# EAGLE design VCA (EAGLE 9.6.2)
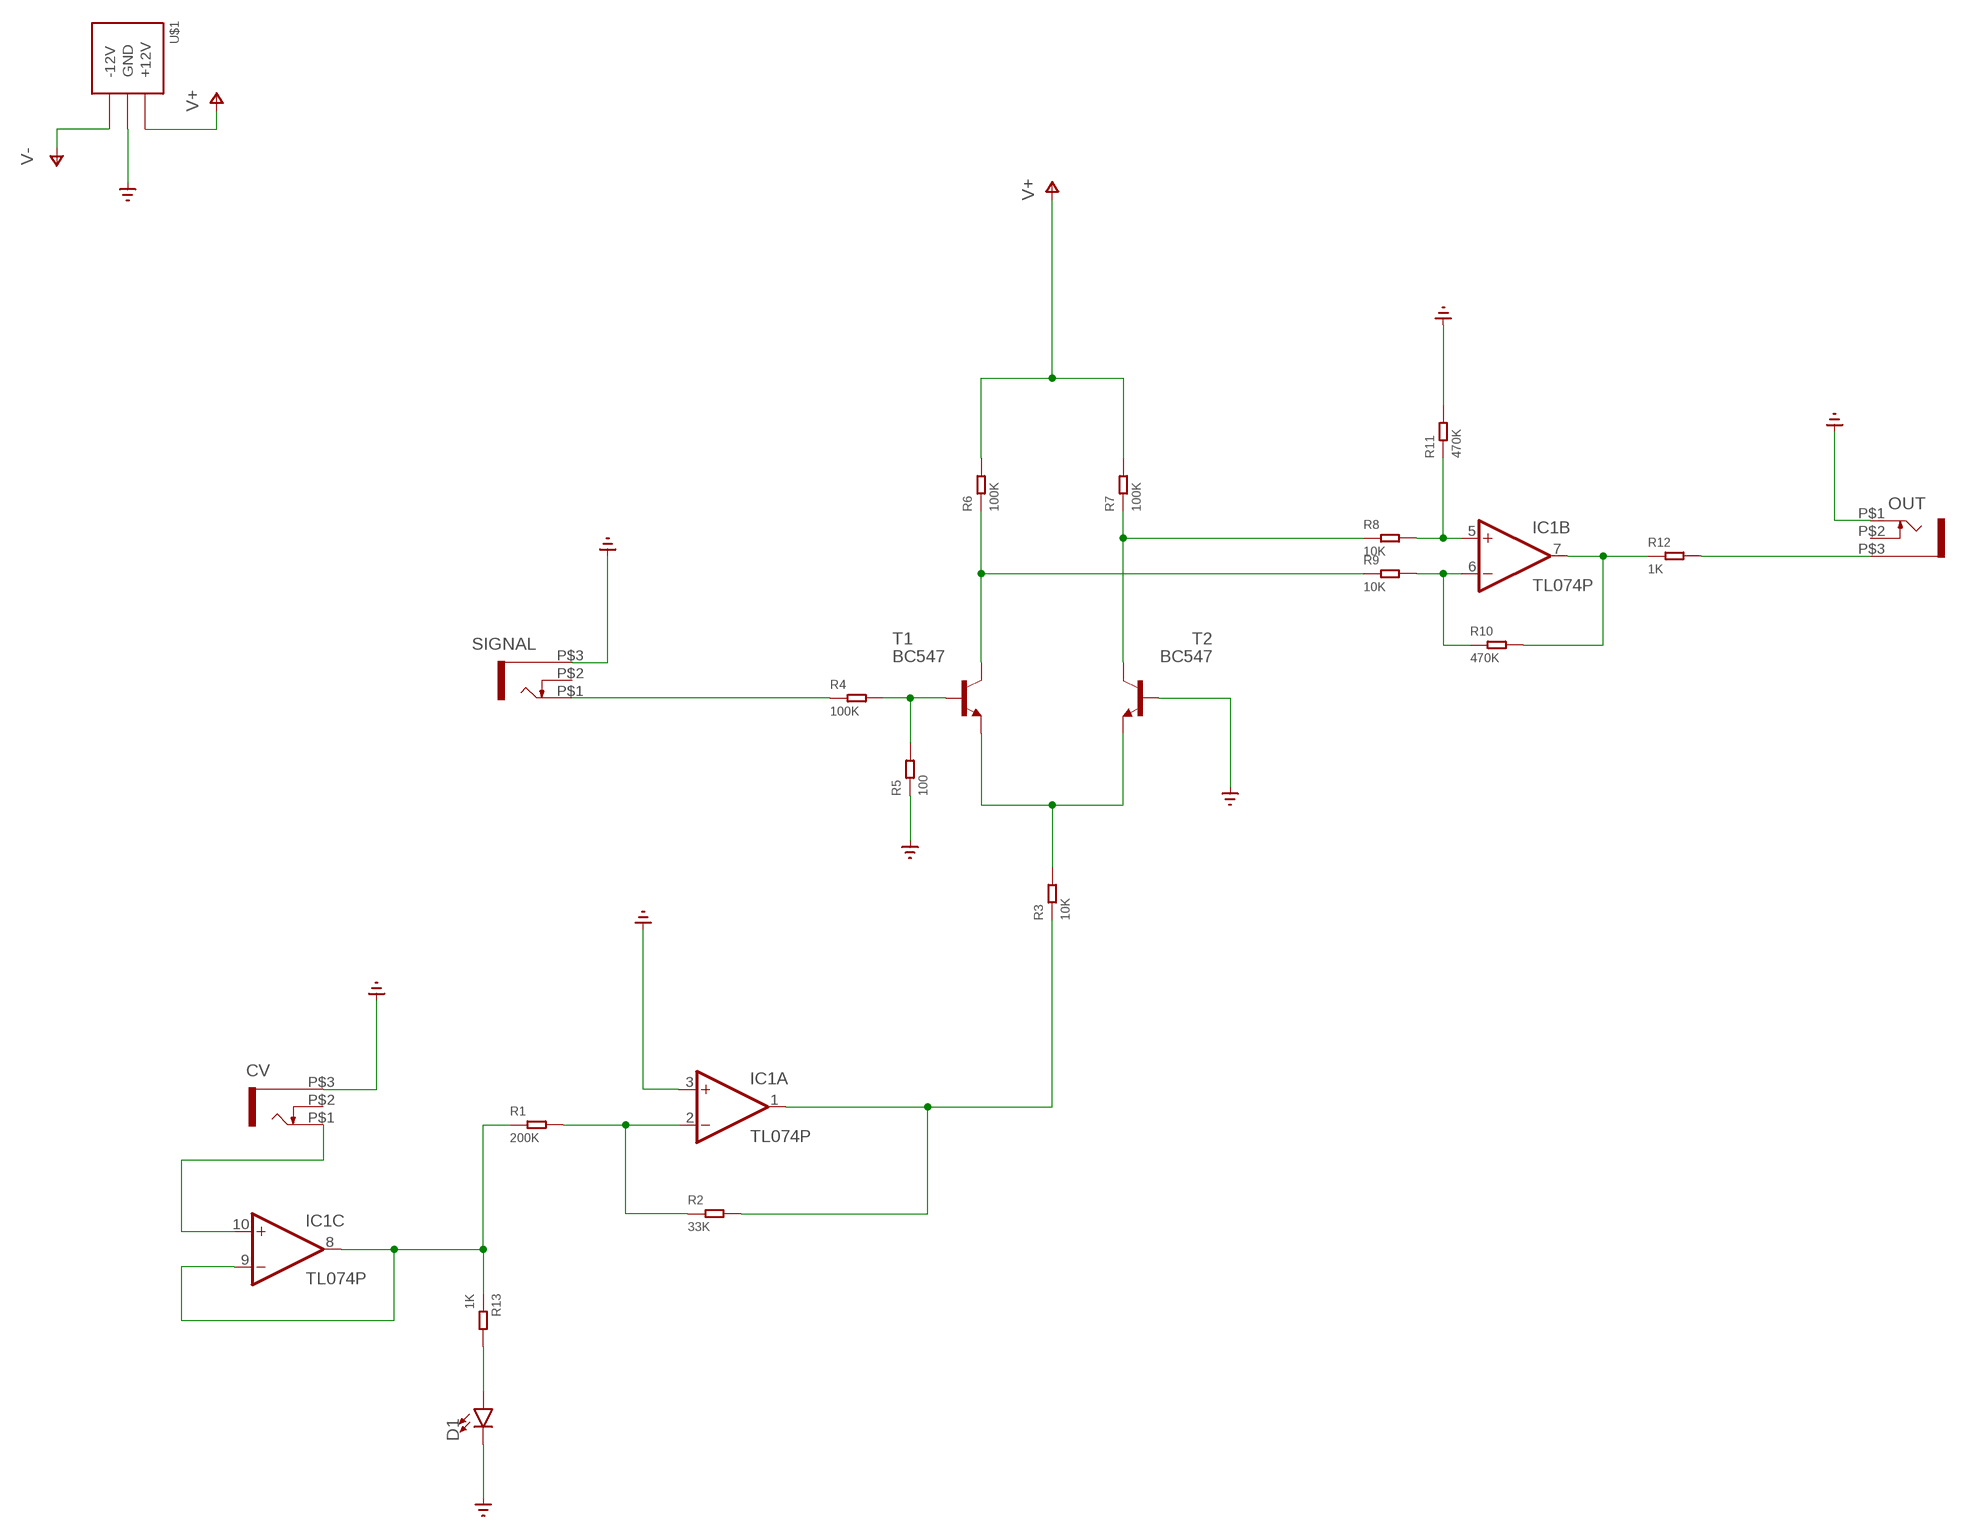
[diagram p0: schematic, sheet 1]

## Parts
CV  WQP-PJ301M-12_JACK  [WQP-PJ301M-12_JACK]
D1  LED3MM  [LED_3MM]
IC1  TL074P  [DIL14]
OUT  WQP-PJ301M-12_JACK  [WQP-PJ301M-12_JACK]
R1  200K  DIP-RES-1K-5%-1/4W(PR-D2.3XL6.5MM)  [PR-D2.3XL6.5MM]
R2  33K  DIP-RES-1K-5%-1/4W(PR-D2.3XL6.5MM)  [PR-D2.3XL6.5MM]
R3  10K  DIP-RES-1K-5%-1/4W(PR-D2.3XL6.5MM)  [PR-D2.3XL6.5MM]
R4  100K  DIP-RES-1K-5%-1/4W(PR-D2.3XL6.5MM)  [PR-D2.3XL6.5MM]
R5  100  DIP-RES-1K-5%-1/4W(PR-D2.3XL6.5MM)  [PR-D2.3XL6.5MM]
R6  100K  DIP-RES-1K-5%-1/4W(PR-D2.3XL6.5MM)  [PR-D2.3XL6.5MM]
R7  100K  DIP-RES-1K-5%-1/4W(PR-D2.3XL6.5MM)  [PR-D2.3XL6.5MM]
R8  10K  DIP-RES-1K-5%-1/4W(PR-D2.3XL6.5MM)  [PR-D2.3XL6.5MM]
R9  10K  DIP-RES-1K-5%-1/4W(PR-D2.3XL6.5MM)  [PR-D2.3XL6.5MM]
R10  470K  DIP-RES-1K-5%-1/4W(PR-D2.3XL6.5MM)  [PR-D2.3XL6.5MM]
R11  470K  DIP-RES-1K-5%-1/4W(PR-D2.3XL6.5MM)  [PR-D2.3XL6.5MM]
R12  1K  DIP-RES-1K-5%-1/4W(PR-D2.3XL6.5MM)  [PR-D2.3XL6.5MM]
R13  1K  DIP-RES-1K-5%-1/4W(PR-D2.3XL6.5MM)  [PR-D2.3XL6.5MM]
SIGNAL  WQP-PJ301M-12_JACK  [WQP-PJ301M-12_JACK]
T1  BC547  [TO92]
T2  BC547  [TO92]
U$1  POWER_SIMPLE10  [POWER_10]

## Nets
GND: CV.P$3 D1.K(C) IC1.3(A:+IN) OUT.P$1 R5.1 R11.2 SIGNAL.P$3 T2.2(B) U$1.3(GND) U$1.4(GND) U$1.5(GND) U$1.6(GND) U$1.7(GND) U$1.8(GND) ; supply symbol labelled SUPPLY0_GND_
N$1: IC1.2(A:-IN) R1.2 R2.1
N$2: R3.2 T1.1(E) T2.1(E)
N$3: IC1.1(A:OUT) R2.2 R3.1
N$4: R4.1 SIGNAL.P$1
N$5: R4.2 R5.2 T1.2(B)
N$6: CV.P$1 IC1.10(C:+IN)
N$7: R6.1 R9.1 T1.3(C)
N$8: R7.1 R8.1 T2.3(C)
N$9: IC1.8(C:OUT) IC1.9(C:-IN) R1.1 R13.1
N$10: IC1.5(B:+IN) R8.2 R11.1
N$11: IC1.6(B:-IN) R9.2 R10.1
N$12: IC1.7(B:OUT) R10.2 R12.1
N$13: OUT.P$3 R12.2
N$14: D1.A R13.2
V+: R6.2 R7.2 U$1.9(+12V) U$1.10(+12V)
V-: U$1.1(-12V) U$1.2(-12V)
Unconnected: CV.P$2 IC1.12(D:+IN) IC1.13(D:-IN) IC1.14(D:OUT) OUT.P$2 SIGNAL.P$2

## Power pins joined to a net without a drawn wire
V+: IC1.4(P:V+)
V-: IC1.11(P:V-)

## Library data of the parts
CV OUT SIGNAL = thonkiconn:WQP-PJ301M-12_JACK
D1 = SparkFun-LED:LED: LED (Generic) Standard schematic elements and footprints for 5mm, 3mm, 1206, and 0603 sized LEDs. Generic LEDs with no color specified.; PROD_ID: DIO-08794
IC1 = linear2:TL074: OP AMP
R1-R11 = Seeed-Resistor:DIP-RES-1K-5%-1/4W(PR-D2.3XL6.5MM): 301020000; MPN: FHCFR-1/4W-102J; VALUE: 1K
R12 R13 = Seeed-Resistor:DIP-RES-1K-5%-1/4W(PR-D2.3XL6.5MM): 301020000; MPN: FHCFR-1/4W-102J
T1 T2 = transistor:BC547: NPN TRANSISTOR
U$1 = EurorackModularParts:POWER_SIMPLE

## Board
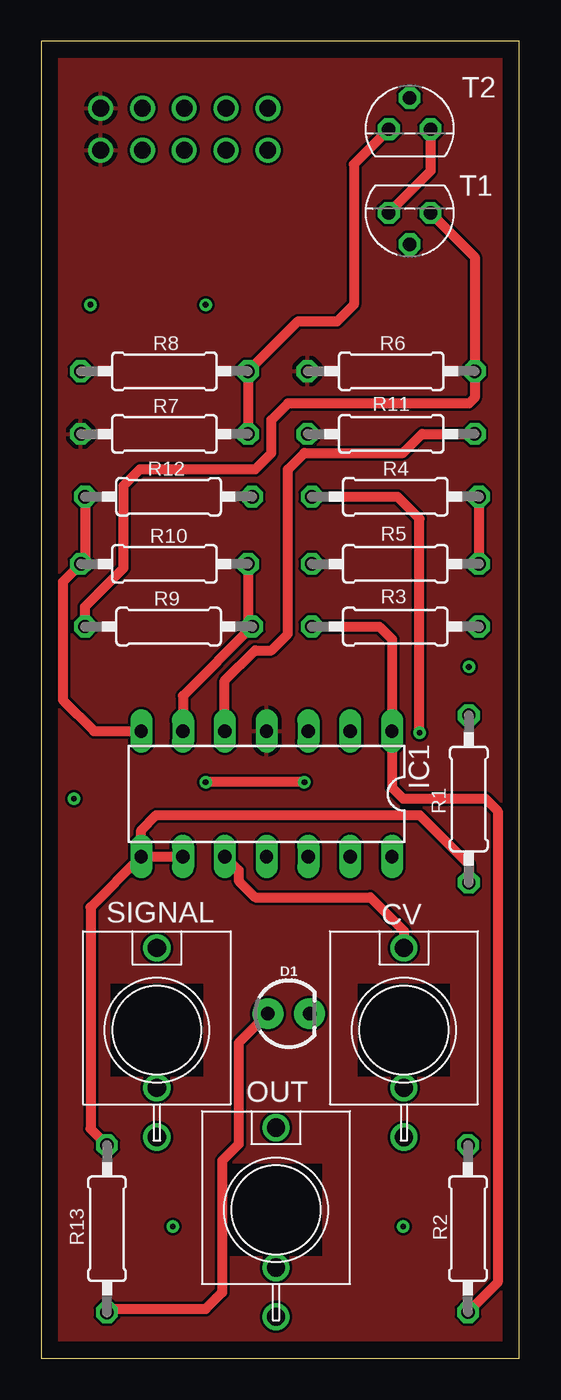
[diagram p1: board, top side]
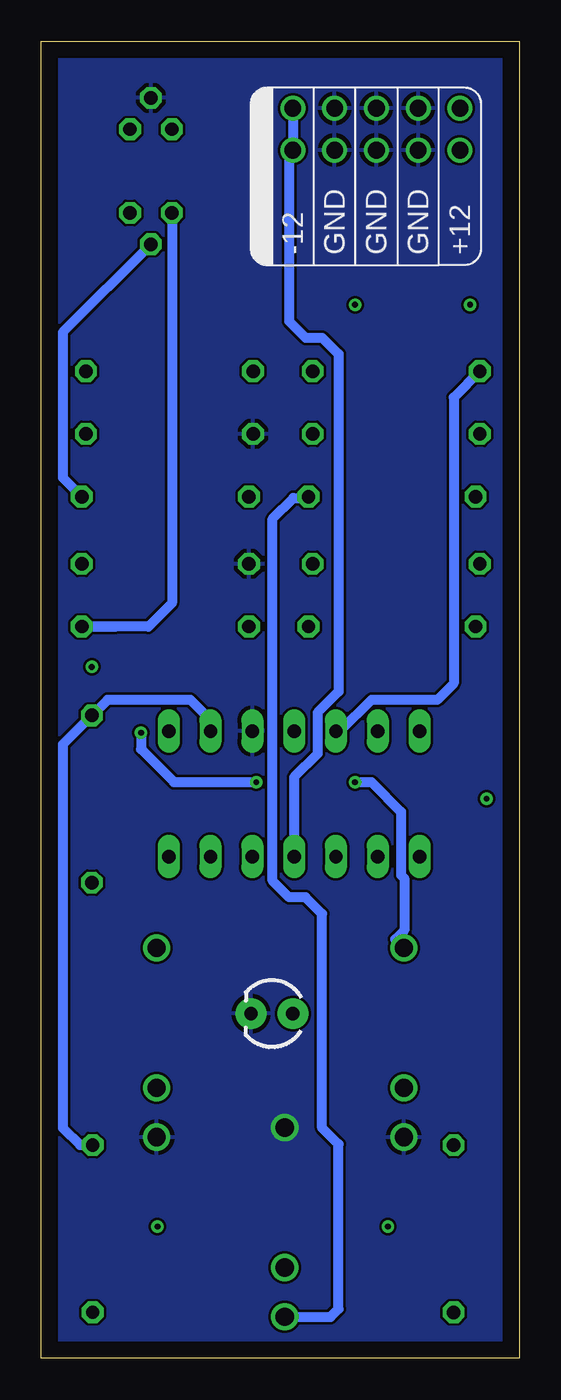
[diagram p2: board, bottom side, seen from below]

Size 29.07 x 80.01 mm. Coordinates in mm from the lower left corner, seen from the top.
Outline: 0,0 29.07,0.01 29.07,80.01 0,80 0,0
Copper layers (1*16): Top 0.035mm / dielectric 1.5mm / Bottom 0.035mm
Design rules "default": minimum track width 6mil, minimum drill 0.35mm, track to track 6mil, track to pad 6mil, pad to pad 6mil, via to via 6mil, smd to smd 6mil, copper to edge 40mil, drill to drill 6mil, minimum pad ring 10mil, minimum via ring 8mil, stop-mask expansion 4mil, vias tented up to drill 0mil, thermal gap 10mil

### Footprints (pad centres in the part's own frame; a part is rotated, then mirrored left to right if it is on the bottom)
WQP-PJ301M-12_JACK = drill 1.1: P$1 0,5; P$2 0,-3.5; P$3 0,-6.5
LED_3MM = drill 0.813 pad 1.88: A -1.27,0; K 1.27,0
DIL14 = drill 0.813 long: 1 -7.62,-3.81; 2 -5.08,-3.81; 3 -2.54,-3.81; 4 0,-3.81; 5 2.54,-3.81; 6 5.08,-3.81; 7 7.62,-3.81; 8 7.62,3.81; 9 5.08,3.81; 10 2.54,3.81; 11 0,3.81; 12 -2.54,3.81; 13 -5.08,3.81; 14 -7.62,3.81
PR-D2.3XL6.5MM = drill 0.813 octagon: 1 -4.953,0; 2 5.207,0
TO92 = drill 0.813 octagon: 1 1.27,0; 2 0,1.905; 3 -1.27,0
POWER_10 = drill 1.016: 1 -5.08,-1.27; 2 -5.08,1.27; 3 -2.54,-1.27; 4 -2.54,1.27; 5 0,-1.27; 6 0,1.27; 7 2.54,-1.27; 8 2.54,1.27; 9 5.08,-1.27; 10 5.08,1.27

### Placement (x,y rotation side)
CV  22.05,19.94 0 top
D1  15.05,20.94 0 top
IC1  13.7,34.29 180 top
OUT  14.27,9.02 0 top
R1  25.99,33.85 90 top
R2  25.94,8.01 270 top
R3  21.4,44.45 0 top
R4  21.4,52.34 0 top
R5  21.4,48.26 0 top
R6  21.4,59.96 180 top
R7  7.62,56.15 180 top
R8  7.62,59.96 180 top
R9  7.62,44.45 0 top
R10  7.62,48.26 180 top
R11  21.4,56.15 180 top
R12  7.62,52.34 0 top
R13  4,8 270 top
SIGNAL  7.03,19.94 0 top
T1  22.4,69.58 180 top
T2  22.4,74.66 0 top
U$1  8.7,74.66 0 bottom

### Tracks (layer width: path | path; a pad name or v marks a point on that pad's centre or on a via)
GND
  pour Bottom: 0,80 0,0 29,0 29,80
N$1
  Bottom 0.61: R2.1 26.71,12.96 27.75,14 27.75,37.29 R1.2 25.05,40 20,40 18.78,38.78 IC1.2
N$2
  Top 0.61: T2.1 23.67,72.12 T1.1
  Bottom 0.61: 24.55,44.45 R3.2 22.55,44.45 21.13,45.87 T1.1
N$3
  Top 0.61: R2.2 27.75,4.61 27.75,33.25 27,34 22,34 21.32,34.68 IC1.1 21.32,43.68 20.55,44.45 R3.1
N$4  (via drill 0.35)
  Top 0.61: v23,38 23,51 21.66,52.34 R4.1 | v16,35 v10,35
  Bottom 0.61: v23,38 23,37 21,35 v16,35 | SIGNAL.P$1 7.55,25.45 7,26 7,29.16 7.2,29.36 7.2,33.2 9,35 v10,35
N$5
  Top 0.61: R4.2 R5.2
  Bottom 0.61: R4.2 27.75,53.49 27.75,62.32 T1.2
N$6
  Top 0.61: IC1.10 12,29.64 12,29 13,28 20,28 22.05,25.95 CV.P$1
N$7
  Top 0.61: T1.3 26.35,66.9 R6.1 26.35,58.35 26,58 15,58 14,57 14,55 13,54 6,54 5,53 5,48 2.67,45.67 R9.1
N$8
  Top 0.61: R7.1 R8.1 15.61,63 18,63 19,64 19,72.53 T2.3
N$9
  Top 0.61: R1.1 25.99,30.01 23,33 7,33 6.08,32.08 IC1.8 | IC1.8 IC1.9 | IC1.8 3,27.4 3,13.95 R13.1
N$10
  Top 0.61: IC1.5 11.16,41.16 13,43 14,43 15,44 15,54 16,55 22,55 23.15,56.15 R11.1
  Bottom 0.61: R8.2 4,58.37 4,41 5,40 9,40 10.9,38.1 IC1.5
N$11
  Top 0.61: R10.1 12.57,44.7 R9.2 8.62,40.24 IC1.6
N$12
  Top 0.61: R12.1 2.67,48.51 R10.2 1.32,47.17 1.32,40 3.22,38.1 IC1.7
N$13
  Bottom 0.61: R12.2 12.74,52.26 13.74,52.26 15,51 15,29 14,28 13,28 12,27 12,14 11,13 11,3 11.48,2.52 OUT.P$3
N$14
  Top 0.61: R13.2 4.21,3 10,3 11,4 11,12 12,13 12,19.16 D1.A
N$15  (via drill 0.35)
  other vias: 2,34
N$16  (via drill 0.35)
  other vias: 8,8
N$17  (via drill 0.35)
  other vias: 22,8
N$18  (via drill 0.35)
  other vias: 26,42
N$19  (via drill 0.35)
  other vias: 3,64
N$20  (via drill 0.35)
  other vias: 10,64
V+
  pour Top: -1,81 -1,-1 30,-1 30,81
V-
  Bottom 0.61: U$1.2 U$1.1 14,73.17 14,63 13,62 12,62 11,61 11,40.5 12.28,39.22 12.28,36.72 13.7,35.3 13.7,34.3 13.7,34 IC1.11